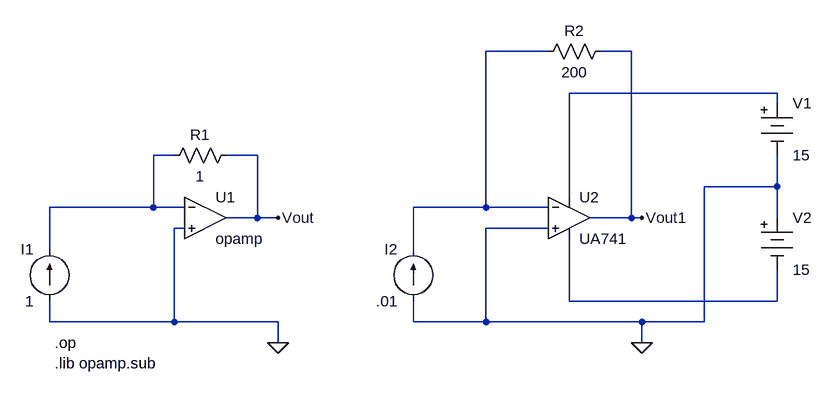
[diagram p0: schematic g3_p23.asc]
g3_p23.asc, the LTspice schematic file:
Version 4
SHEET 1 1096 680
WIRE 688 -112 592 -112
WIRE 816 -112 768 -112
WIRE 1040 -48 720 -48
WIRE 1040 -32 1040 -48
WIRE 112 48 80 48
WIRE 240 48 192 48
WIRE 1040 96 1040 48
WIRE 1040 96 928 96
WIRE 720 112 720 -48
WIRE 80 128 80 48
WIRE 80 128 -80 128
WIRE 128 128 80 128
WIRE 592 128 592 -112
WIRE 592 128 480 128
WIRE 688 128 592 128
WIRE 240 144 240 48
WIRE 240 144 192 144
WIRE 272 144 240 144
WIRE 816 144 816 -112
WIRE 816 144 752 144
WIRE 832 144 816 144
WIRE 1040 144 1040 96
WIRE 128 160 112 160
WIRE 688 160 592 160
WIRE -80 192 -80 128
WIRE 480 192 480 128
WIRE 720 272 720 176
WIRE 1040 272 1040 224
WIRE 1040 272 720 272
WIRE -80 304 -80 272
WIRE 112 304 112 160
WIRE 112 304 -80 304
WIRE 272 304 112 304
WIRE 480 304 480 272
WIRE 592 304 592 160
WIRE 592 304 480 304
WIRE 832 304 592 304
WIRE 928 304 928 96
WIRE 928 304 832 304
WIRE 272 336 272 304
WIRE 832 336 832 304
FLAG 272 336 0
FLAG 272 144 Vout
FLAG 832 336 0
FLAG 832 144 Vout1
SYMBOL Opamps\\opamp 160 80 R0
SYMATTR InstName U1
SYMBOL res 208 32 R90
WINDOW 0 0 56 VBottom 2
WINDOW 3 32 56 VTop 2
SYMATTR InstName R1
SYMATTR Value 1
SYMBOL current -80 272 R180
WINDOW 0 24 80 Left 2
WINDOW 3 24 0 Left 2
SYMATTR InstName I1
SYMATTR Value 1
SYMBOL res 784 -128 R90
WINDOW 0 0 56 VBottom 2
WINDOW 3 32 56 VTop 2
SYMATTR InstName R2
SYMATTR Value 200
SYMBOL current 480 272 R180
WINDOW 0 24 80 Left 2
WINDOW 3 24 0 Left 2
SYMATTR InstName I2
SYMATTR Value .01
SYMBOL AutoGenerated\\UA741 720 144 R0
SYMATTR InstName U2
SYMBOL Misc\\battery 1040 -48 R0
SYMATTR InstName V1
SYMATTR Value 15
SYMBOL Misc\\battery 1040 128 R0
SYMATTR InstName V2
SYMATTR Value 15
TEXT -72 336 Left 2 !.op
TEXT -72 368 Left 2 !.lib opamp.sub

The netlist it stands for:
* g3_p23.asc
XU1 N003 0 Vout opamp Aol=100K GBW=10Meg  ; pins invin noninvin out
R1 Vout N003 1
I1 0 N003 1
R2 Vout1 N001 200
I2 0 N001 .01
* U2: UA741 (symbol AutoGenerated\UA741 not available, pins judged from their places): In+=0 In-=N001 V+=N002 V-=N004 OUT=Vout1
V1 N002 0 15
V2 0 N004 15
.op
.lib opamp.sub
.backanno
.end